# EAGLE design USB_RS485_Conv (EAGLE 9.6.2)
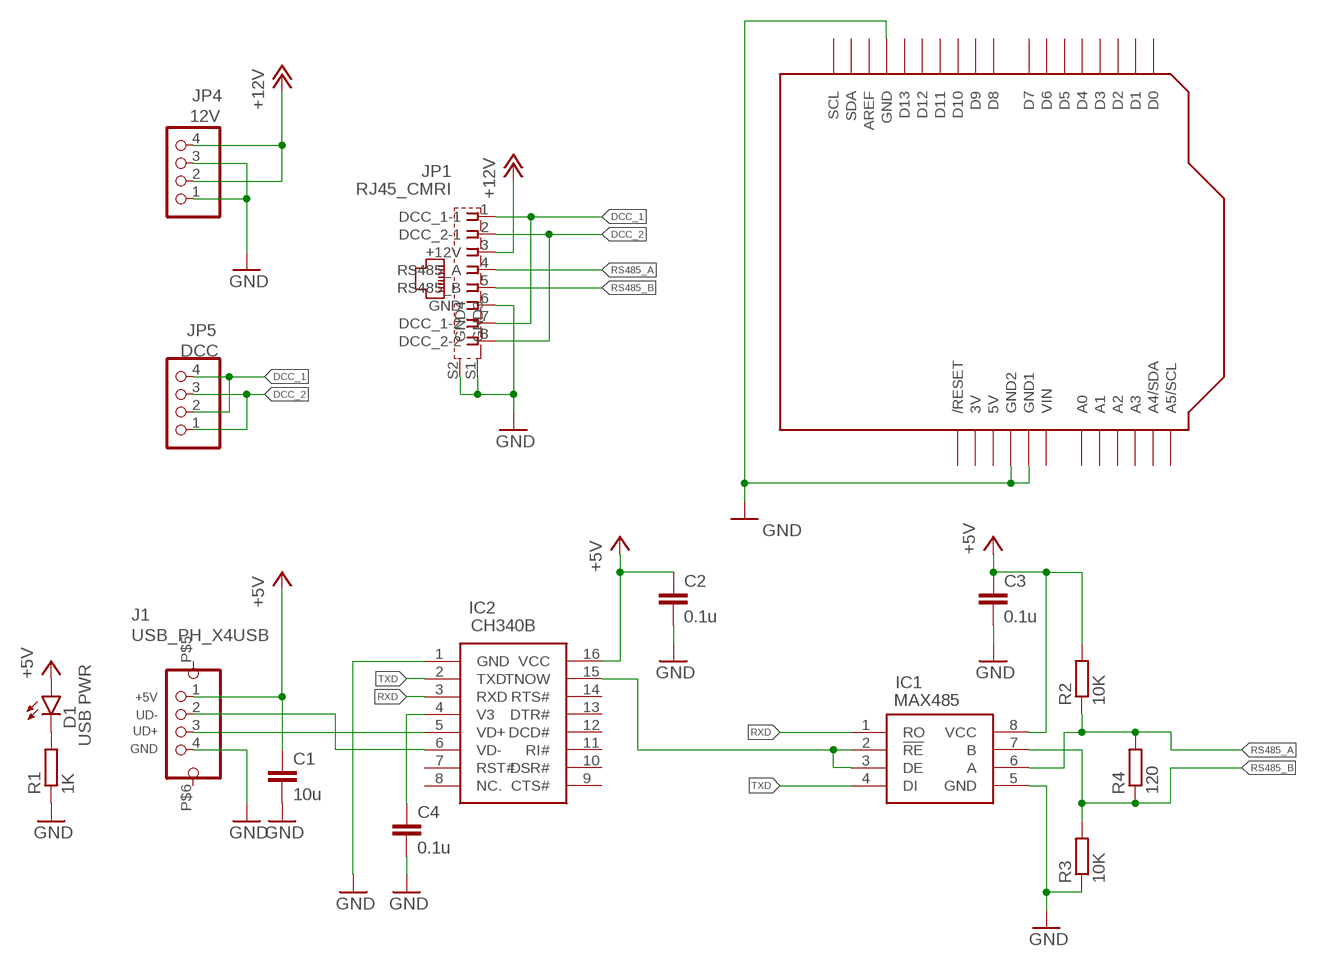
[diagram p0: schematic, sheet 1]

## Parts
C1  10u  C-EUC1206  [C1206]
C2  0.1u  C-EUC1206  [C1206]
C3  0.1u  C-EUC1206  [C1206]
C4  0.1u  C-EUC1206  [C1206]
D1  USB PWR  LEDSMD_1608  [LED_SMD_1608]
IC1  MAX485  MAX485CSA  [SOIC127P600X175-8N]
IC2  CH340B  [SOIC127P600X177-16N]
J1  USB_PH_X4USB  [USB_PH_04/90]
JP1  RJ45_CMRI  [RJ45_7810]
JP4  12V  PINHD-1X4/90  [1X04/90]
JP5  DCC  PINHD-1X4/90  [1X04/90]
Q1  ARDUINO-SHIELD-NOTEXT  [ARDUINO-SHIELD]
R1  1K  R-EU_R1206  [R1206]
R2  10K  R-EU_R1206  [R1206]
R3  10K  R-EU_R1206  [R1206]
R4  120  R-EU_R1206  [R1206]

## Nets
+5V [power]: C1.1 C2.1 C3.1 D1.A IC1.8(VCC) IC2.16(VCC) J1.1 R2.2
+12V [12V]: JP1.3(+12V) JP4.2 JP4.4
DCC_1 [DCC]: JP1.1(DCC_1-1) JP1.7(DCC_1-2) JP5.2 JP5.4
DCC_2 [DCC]: JP1.2(DCC_2-1) JP1.8(DCC_2-2) JP5.1 JP5.3
GND [power]: C1.2 C2.2 C3.2 C4.2 IC1.5(GND) IC2.1(GND) J1.4 JP1.6(GND) JP1.S1(GND3) JP1.S2(GND4) JP4.1 JP4.3 Q1.GND Q1.GND1 Q1.GND2 R1.1 R3.1
N$1: IC2.5(VD+) J1.3
N$2: IC2.6(VD-) J1.2
N$3: C4.1 IC2.4(V3)
N$4: IC1.2(!RE) IC1.3(DE) IC2.15(TNOW)
N$5: D1.C(K) R1.2
RS485_A [analog]: IC1.6(A) JP1.4(RS485_A) R2.1 R4.2
RS485_B [analog]: IC1.7(B) JP1.5(RS485_B) R3.2 R4.1
RXD: IC1.1(RO) IC2.3(RXD)
TXD: IC1.4(DI) IC2.2(TXD)
Unconnected: IC2.7(RST#) IC2.8(NC.) IC2.9(CTS#) IC2.10(DSR#) IC2.11(RI#) IC2.12(DCD#) IC2.13(DTR#) IC2.14(RTS#) J1.P$5 J1.P$6 Q1.3V Q1.5V Q1.A0 Q1.A1 Q1.A2 Q1.A3 Q1.A4(A4/SDA) Q1.A5(A5/SCL) Q1.AREF Q1.D0 Q1.D1 Q1.D2 Q1.D3 Q1.D4 Q1.D5 Q1.D6 Q1.D7 Q1.D8 Q1.D9 Q1.D10 Q1.D11 Q1.D12 Q1.D13 Q1.RESET(/RESET) Q1.SCL Q1.SDA Q1.VIN

## Library data of the parts
C1-C4 = MyRcl:C-EU: CAPACITOR, European symbol; SPICEPREFIX: C
D1 = MyPartslbr:LED: IR LED infrared emitting diode, Infineon
IC1 = MyPartslbr:MAX485CSA: Maxim MAX485CSA, Line Transceiver, RS-422, RS-485, 4.75 5.25 V, 8-Pin SOIC Source: Datasheet <http://uk.rs-online.com/web/p/products/0370854>; DESCRIPTION: Maxim MAX485CSA, Line Transceiver, RS-422, RS-485, 4.75 5.25 V, 8-Pin SOIC; HEIGHT: 1.75mm; MANUFACTURER_NAME: Maxim Integrated; MANUFACTURER_PART_NUMBER: MAX485CSA; RS_PART_NUMBER: 0370854; RS_PRICE-STOCK: http://uk.rs-online.com/web/p/products/0370854
IC2 = MyPartslbr:CH340B: SOP16 Source: Datasheet <https://datasheet.lcsc.com/szlcsc/Sinotech-Mixic-Elec-ULN2003A-DIP16_C112203.pdf>; DESCRIPTION: SOP16; HEIGHT: 1.77mm; MANUFACTURER_NAME: Sinotech Mixic Electronics; MANUFACTURER_PART_NUMBER: ULN2003A-DIP16
J1 = MyPartslbr:USB_PH_X4
JP1 = MyPartslbr:RJ45_CMRI
JP4 JP5 = MyPartslbr:PINHD-1X4: PIN HEADER
Q1 = MyPartslbr:ARDUINO-SHIELD
R1-R4 = MyRcl:R-EU_: RESISTOR, European symbol; SPICEPREFIX: R

## Net classes
0 default: width 0.203 mm, drill 0.254 mm
1 power: width 0.457 mm, drill 0.508 mm
2 analog: width 0.406 mm, drill 0.457 mm
3 12V: width 1.524 mm, drill 1.524 mm
4 DCC: width 1.524 mm, drill 1.524 mm

## Board
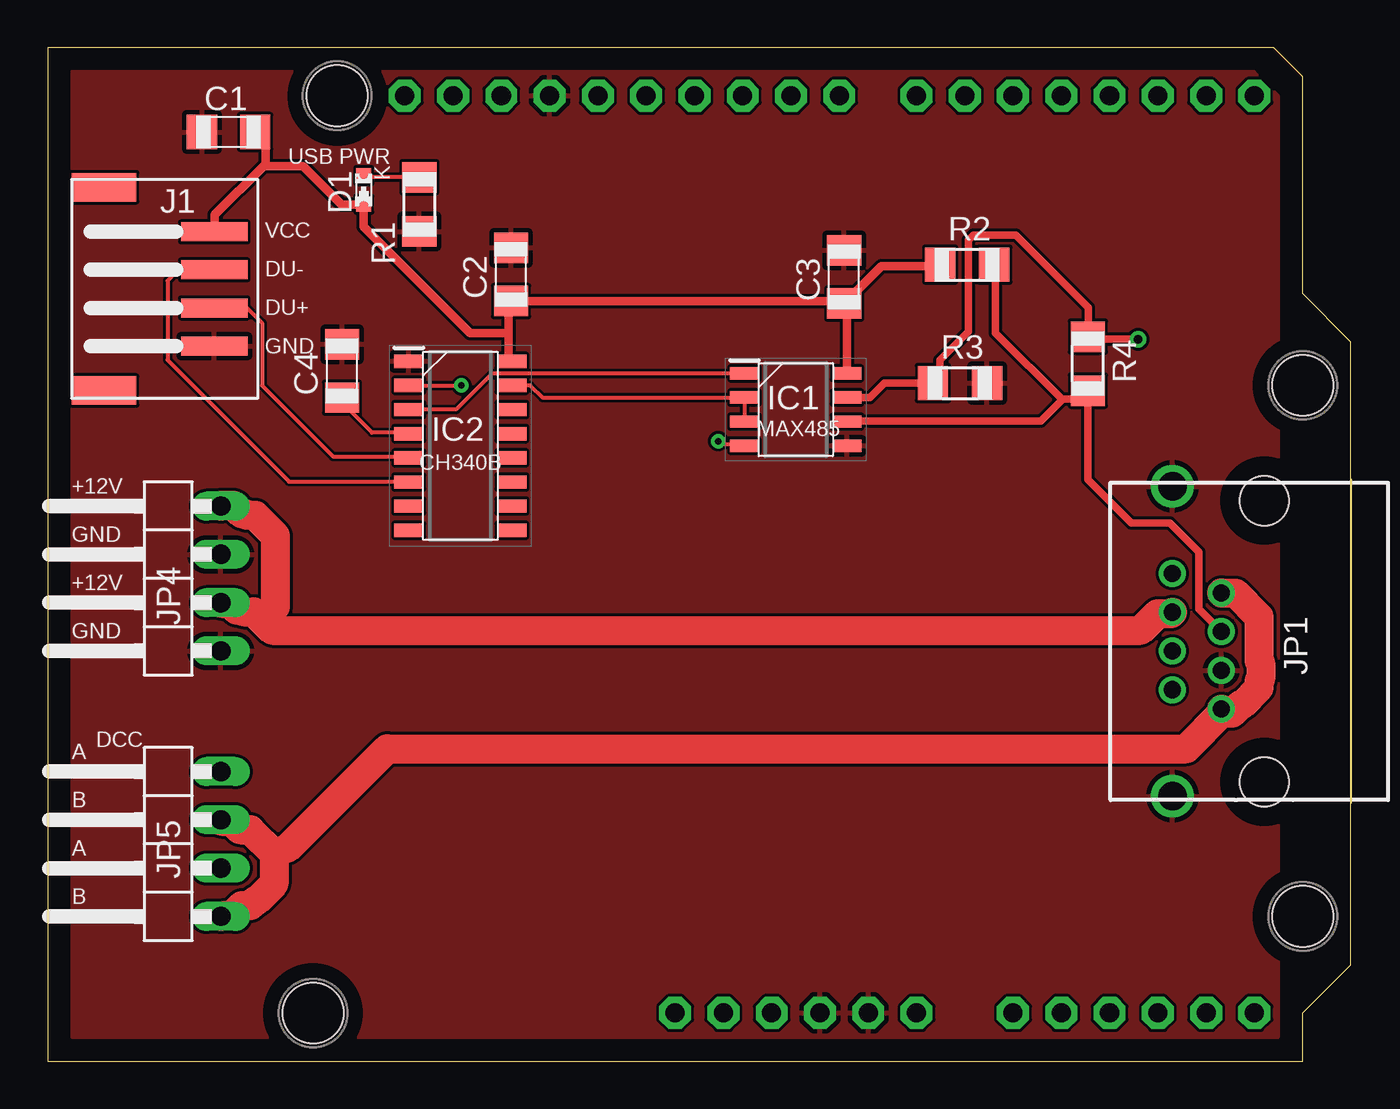
[diagram p1: board, top side]
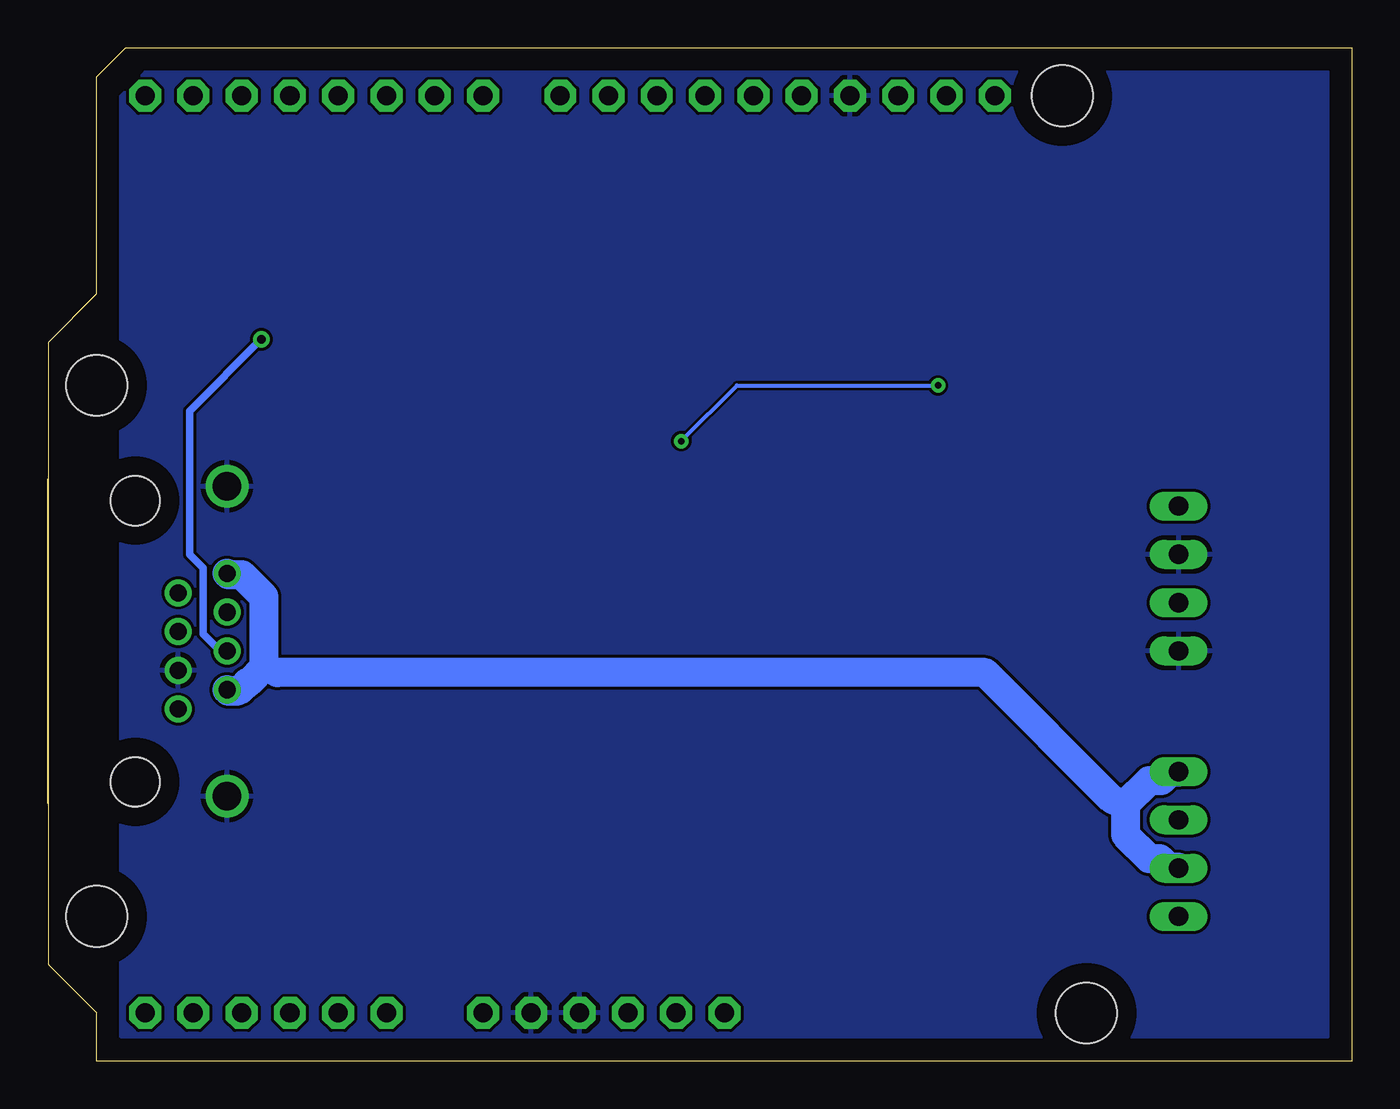
[diagram p2: board, bottom side, seen from below]

Size 68.63 x 53.34 mm. Coordinates in mm from the lower left corner, seen from the top.
Copper layers (1*16): Top 0.035mm / dielectric 1.5mm / Bottom 0.035mm
Design rules "default": minimum track width 6mil, minimum drill 0.35mm, track to track 6mil, track to pad 6mil, pad to pad 6mil, via to via 6mil, smd to smd 6mil, copper to edge 40mil, drill to drill 6mil, minimum pad ring 10mil, minimum via ring 8mil, stop-mask expansion 4mil, vias tented up to drill 0mil, thermal gap 10mil

### Footprints (pad centres in the part's own frame; a part is rotated, then mirrored left to right if it is on the bottom)
C1206 = smd 1.6 x 1.8: 1 -1.4,0; 2 1.4,0
LED_SMD_1608 = smd 0.8 x 0.8: A 0,-0.75; C 0,0.75
SOIC127P600X175-8N = smd 1.5 x 0.65: 1 -2.7,1.905; 2 -2.7,0.635; 3 -2.7,-0.635; 4 -2.7,-1.905; 5 2.7,-1.905; 6 2.7,-0.635; 7 2.7,0.635; 8 2.7,1.905
SOIC127P600X177-16N = smd 1.525 x 0.7: 1 -2.712,4.445; 2 -2.712,3.175; 3 -2.712,1.905; 4 -2.712,0.635; 5 -2.712,-0.635; 6 -2.712,-1.905; 7 -2.712,-3.175; 8 -2.712,-4.445; 9 2.712,-4.445; 10 2.712,-3.175; 11 2.712,-1.905; 12 2.712,-0.635; 13 2.712,0.635; 14 2.712,1.905; 15 2.712,3.175; 16 2.712,4.445
USB_PH_04/90 = smd 1 x 3.5: 1 3,-7.5; 2 1,-7.5; 3 -1,-7.5; 4 -3,-7.5 | smd 1.5 x 3.4: P$5 -5.35,-1.7; P$6 5.35,-1.7
RJ45_7810 = drill 0.9 pad 1.422: 1 3.57,0; 2 2.55,-2.58; 3 1.53,0; 4 0.51,-2.58; 5 -0.51,0; 6 -1.53,-2.58; 7 -2.55,0; 8 -3.57,-2.58 | drill 1.5 pad 2.184: S1 8.15,0; S2 -8.15,0 | hole 2.6: -7.4,-4.84; 7.4,-4.84
1X04/90 = drill 1.016 long: 1 -3.81,-4.04; 2 -1.27,-4.04; 3 1.27,-4.04; 4 3.81,-4.04
ARDUINO-SHIELD = drill 1 pad 1.676 octagon: 3V 35.56,2.54; 5V 38.1,2.54; A0 50.8,2.54; A1 53.34,2.54; A2 55.88,2.54; A3 58.42,2.54; A4 60.96,2.54; A5 63.5,2.54; AREF 23.876,50.8; D0 63.5,50.8; D1 60.96,50.8; D2 58.42,50.8; D3 55.88,50.8; D4 53.34,50.8; D5 50.8,50.8; D6 48.26,50.8; D7 45.72,50.8; D8 41.656,50.8; D9 39.116,50.8; D10 36.576,50.8; D11 34.036,50.8; D12 31.496,50.8; D13 28.956,50.8; GND 26.416,50.8; GND1 43.18,2.54; GND2 40.64,2.54; RESET 33.02,2.54; SCL 18.796,50.8; SDA 21.336,50.8; VIN 45.72,2.54 | hole 3.2: 15.24,50.8; 13.97,2.54; 66.04,7.62; 66.04,35.56
R1206 = smd 1.6 x 1.803: 1 -1.422,0; 2 1.422,0

### Placement (x,y rotation side)
C1  9.53,48.9 180 top
C2  24.38,41.4 90 top
C3  41.91,41.27 90 top
C4  15.49,36.32 90 top
D1  16.64,45.85 0 top
IC1  39.37,34.29 0 top
IC2  21.72,32.38 0 top
J1  1.27,40.64 90 top
JP1  59.18,22.1 90 top
JP4  5.08,25.4 90 top
JP5  5.08,11.43 90 top
Q1  0,0 0 top
R1  19.56,45.09 90 top
R2  48.39,41.91 180 top
R3  48.01,35.69 180 top
R4  54.74,36.7 270 top

### Tracks (layer width: path | path; a pad name or v marks a point on that pad's centre or on a via)
+5V
  Top 0.457: IC1.8 42.05,36.27 42.05,39.73 C3.1 | 24.27,38.32 24.27,36.89 24.45,36.89 IC2.16 | 24.27,38.32 22.23,38.32 16.62,43.92 16.62,44.9 D1.A 16.62,45.07 15.47,45.07 13.44,47.1 11.37,47.1 | 11.37,47.1 11.47,47.21 11.47,48.35 C1.1 | 11.37,47.1 8.8,44.54 8.8,43.65 J1.1 | 24.27,38.32 24.27,39.89 C2.1 41.78,40 C3.1 | C3.1 43.88,41.85 46.9,41.85 R2.2
+12V
  Top 1.524: 11.29,23.2 10.85,23.65 10.31,23.65 10.22,23.74 9.96,23.74 9.6,24.09 9.16,24.09 JP4.2 | 11.29,23.2 11.82,22.67 57.52,22.67 58.41,23.56 59.12,23.56 JP1.3 | JP4.4 9.16,29.25 9.78,29.25 10.22,28.8 10.4,28.8 10.49,28.71 10.94,28.71 12,27.65 12,23.91 11.29,23.2
DCC_1
  Bottom 1.524: 57.25,20.71 58.05,19.91 58.14,19.91 58.5,19.56 58.59,19.56 58.67,19.47 59.12,19.47 JP1.7 | 57.25,20.71 57.25,24.45 58.41,25.6 59.12,25.6 JP1.1 | 11.91,13.51 11.91,11.91 10.67,10.67 10.13,10.67 9.69,10.22 9.16,10.22 JP5.2 | 11.91,13.51 10.67,14.76 10.05,14.76 9.6,15.2 9.16,15.2 JP5.4 | 57.25,20.71 56.54,20.45 19.29,20.45 12.62,13.78 11.91,13.51
DCC_2
  Top 1.524: 61.87,18.4 61.96,18.31 62.32,18.31 62.76,18.76 62.85,18.76 63.74,19.65 63.74,20 63.83,20.09 63.83,20.98 63.74,21.07 63.74,23.38 62.5,24.62 61.78,24.62 JP1.2 | 61.87,18.4 61.78,18.49 JP1.8 | 11.91,10.94 11.91,9.34 11.02,8.45 10.94,8.45 10.67,8.18 10.22,8.18 9.69,7.64 9.16,7.64 JP5.1 | 11.91,10.94 10.67,12.18 10.13,12.18 9.69,12.62 9.16,12.62 JP5.3 | 61.87,18.4 59.92,16.45 17.87,16.45 12.62,11.2 11.91,10.94
GND
  pour Top: 1.27,52.07 1.27,1.27 64.77,1.27 64.77,50.8 63.5,52.07
  pour Bottom: 1.27,52.07 1.27,1.27 64.77,1.27 64.77,50.8 63.5,52.07
N$1
  Top 0.203: J1.3 8.8,39.65 10.49,39.65 11.29,38.85 11.29,35.56 15.02,31.83 18.94,31.83 IC2.5
N$2
  Top 0.203: J1.2 8.71,41.6 8.62,41.52 6.76,41.52 6.31,41.07 6.31,36.89 12.71,30.49 18.94,30.49 IC2.6
N$3
  Top 0.203: IC2.4 18.94,33.07 17.07,33.07 15.49,34.65 C4.1
N$4
  Top 0.203: IC1.3 IC1.2 26.04,34.92 25.4,35.56 IC2.15
N$5
  Top 0.203: R1.2 16.73,46.51 D1.C
RS485_A
  Top 0.406: 53.38,34.8 53.43,34.85 54.32,34.85 54.67,35.2 R4.2 54.74,30.61 57.02,28.32 59.05,28.32 60.58,26.8 60.58,23.79 JP1.4 | 53.38,34.8 52.27,33.69 42.14,33.69 IC1.6 | 53.38,34.8 49.87,38.32 49.87,41.87 R2.1
RS485_B  (via drill 0.46)
  Top 0.406: IC1.7 43.28,34.92 44.03,35.67 45.39,35.67 45.43,35.69 R3.2 46.67,35.83 46.94,36.09 46.94,36.89 48.45,38.41 48.45,43.2 48.72,43.47 50.94,43.47 54.76,39.65 54.76,38.14 R4.1 54.85,37.96 54.83,37.99 v57.38,37.99
  Bottom 0.406: v57.38,37.99 61.16,34.2 61.16,26.67 60.45,25.96 60.45,22.48 59.56,21.59 JP1.5
RXD
  Top 0.203: IC1.1 36.65,36.18 23.38,36.18 21.49,34.29 IC2.3
TXD  (via drill 0.35)
  Top 0.203: v35.29,32.63 35.47,32.45 36.63,32.45 IC1.4 | IC2.2 v21.78,35.56
  Bottom 0.203: v21.78,35.56 32.36,35.56 v35.29,32.63

### Text on the board
tNames: K | +12V | GND | +12V | GND | DCC | A | B | A | B